# Altium schematic sheet Sheet1.SchDoc
size A; SheetNumber: 1; SheetTotal: 1
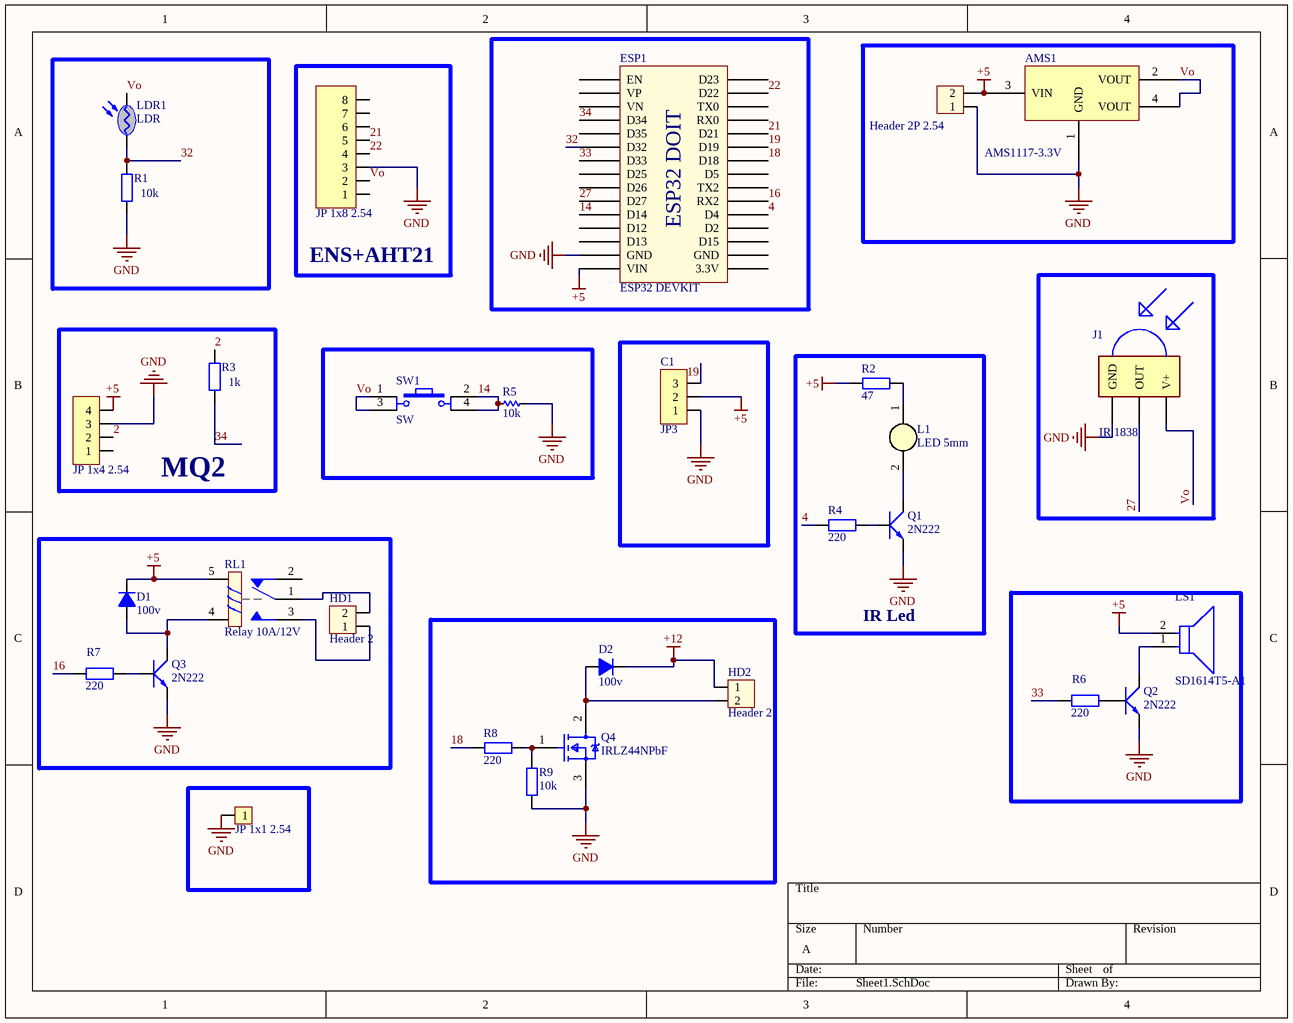
[diagram p0: Sheet1.SchDoc]

## Parts
AMS1  AMS1117-3.3V  [SOT223]
C1  JP3  [JP3-C1T]
D1  100v  [DIODE 1A]
D2  100v  [DIODE 1A]
ESP1  ESP32 DEVKIT  [ESP32 WROOM 32 KIT]
H1  Header 2P 2.54  [XH2.54M-2]
HD1  Header 2  [HED2]
HD2  Header 2  [HED2]
J1  IR 1838  [IR 1838]
JP1  JP 1x8 2.54  [JP 1x8 DT]
JP2  JP 1x4 2.54  [JP 1x4 CT]
JP3  JP 1x1 2.54  [JP 1x1 DT]
L1  LED 5mm  [LED-5MM-WHITE]
LDR1  LDR  [CDS]
LS1  SD1614T5-A1  [FP-SD1614T5-A1-MFG]
Q1  2N222  [TO92-123]
Q2  2N222  [TO92-123]
Q3  2N222  [TO92-123]
Q4  IRLZ44NPbF  [FP-PG-TO220-3-MFG]
R1  10k  [R1/4W]
R2  47  [R1/4W]
R3  1k  [R1/4W]
R4  220  [R1/4W]
R5  10k  [RES-1/2W]
R6  220  [R1/4W]
R7  220  [R1/4W]
R8  220  [R1/4W]
R9  10k  [R1/4W]
RL1  Relay 10A/12V  [RELAY 5]
SW1  SW  [SW4]

## Blocks framed on the sheet
ENS+AHT21: JP1
MQ2: JP2 R3
IR Led: L1 Q1 R2 R4

## Nets
+5: AMS1.3(VIN) C1.2 D1.2(K) ESP1.15(VIN) H1.2 JP2.4 LS1.2(A) R2.1 RL1.5
+12: D2.2(K) HD2.1
GND: AMS1.1(GND) C1.1 ESP1.14(GND) H1.1 J1.GND JP1.3 JP2.3 JP3.1 Q1.1(E) Q2.1(E) Q3.1(E) Q4.3(S) R1.1 R5.1 R9.1
2: JP2.2 R3.2
4: ESP1.20(D4) R4.1
14: ESP1.11(D14) R5.2 SW1.2 SW1.4
16: ESP1.21(RX2) R7.1
18: ESP1.24(D18) R8.1
19: C1.3 ESP1.25(D19)
21: ESP1.26(D21) JP1.5
22: ESP1.29(D22) JP1.4
27: ESP1.10(D27) J1.OUT
32: ESP1.6(D32) LDR1.1(A) R1.2
33: ESP1.7(D33) R6.1
34: ESP1.4(D34) R3.1
Vo: AMS1.2(VOUT) AMS1.4(VOUT) J1.VCC(V+) JP1.2 LDR1.2(K) SW1.1 SW1.3
NetD1_1: D1.1(A) Q3.3(C) RL1.4
NetD2_1: D2.1(A) HD2.2 Q4.2(D)
NetHD1_1: HD1.1 RL1.3
NetHD1_2: HD1.2 RL1.1
NetL1_1: L1.1(A) R2.2
NetL1_2: L1.2(K) Q1.3(C)
NetLS1_1: LS1.1(C) Q2.3(C)
NetQ1_2: Q1.2(B) R4.2
NetQ2_2: Q2.2(B) R6.2
NetQ3_2: Q3.2(B) R7.2
NetQ4_1: Q4.1(G) R8.2 R9.2

Not connected (* = marked no-connect by the designer): ESP1 1(EN) 2(VP) 3(VN) 5(D35) 8(D25) 9(D26) 12(D12) 13(D13) 16(3.3V) 17(GND) 18(D15) 19(D2) 22(TX2) 23(D5) 27(RX0) 28(TX0) 30(D23); JP1 1 6 7 8; JP2 1; RL1 2

## Notes on the sheet
- (in symbol ESP32 WROOM 32 KIT) ESP32 DOIT

## Library data of the parts
AMS1 = AMS1117 SMD: Dán; Value: AMS1117-3.3V SOT223; Don_Vi: Con; Ma_Hang: MH000596; Ghi_Chu: *; Kieu_Chan: *; Chung_Loai: Dán
C1 = JP3: WR-PHD 2.54 mm Angled Socket Header; Manufacturer: W¨¹rth Elektronik eiSos GmbH; partNo: 613003143121; ComponentLink1 Description: Manufacturer; ComponentLink2 Description: Datasheet; NoPins: 03; Created Date: 29 March 2013; ComponentLink1URL: http://www.we-online.com; ComponentLink2URL: http://katalog.we-online.de/em/datasheet/6130xx143121.pdf; Created by: Karrer Zheng
D1 D2 = Diode 1N4007: Cắm; Ten_Linh_Kien: Diode 1N4007 1A (DIP); Don_Vi: Con; Ma_Hang: MH001063; Ghi Chu: *; Kieu_Chan: *; Chung_Loai: Cắm
ESP1 = ESP32 WROOM 32 KIT
H1 = Header 2P 2.54 Duc Thang: Cắm; Ten_Linh_Kien: Header 2P XH2.54-2P Đực Thẳng; Don_Vi: Con; Ma_Hang: MH001283; Chung_Loai: Cắm
HD1 HD2 = Hed2: Header 2 (Green); Value: Header 2
J1 = IR 1838: IR Receiver and Demodulator; MP: TSOP1838; Value: *; Package: None; Availability: Unavailable; Price: None
JP1 = JP 1x8 2.54 Duc Thang: Cắm; Ten_Linh_Kien: Jump Đơn Đực 2.54MM 1x40P Thẳng 11MM; Don_Vi: Con; Ma_Hang: MH000903; Ghi_Chu: *; Kieu_Chan: *; Chung_Loai: Cắm
JP2 = JP 1x4 2.54 Cai Thang: Cắm; Ten_Linh_Kien: Jump Đơn Cái 2.54MM 1x20P Thẳng; Don_Vi: Con; Ma_Hang: MH004006; Ghi_Chu: *; Kieu_Chan: *; Chung_Loai: Cắm
JP3 = JP 1x1 2.54 Duc Cong: Cắm; Ten_Linh_Kien: Jump Đơn Đực 2.54MM 1x40P Cong Đứng; Don_Vi: Con; Ma_Hang: MH000904; Ghi_Chu: *; Kieu_Chan: *; Chung_Loai: Cắm
L1 = LED 5mm Trang: Cắm; Don_Vi: Con; Ma_Hang: MH008983; Ten_Linh_Kien: Led 5MM Trắng Đục (1000c); Ghi_Chu: *; Kieu_Chan: *; Chung_Loai: Cắm
LDR1 = LDR: Quang Tro
LS1 = CMP-08413-000005-1: BUZZER MAGNETIC 5V 80DB 2048HZ 1; Frequency: 2.048kHz; Operating Supply Current: 80mA; Max Operating Temperature: 85°C; Min Operating Temperature: -40°C; Voltage Rating: 5V; Termination: PC Pins; Sensing Method: Magnetic; Mount: Panel
Q1-Q3 = 2N222: NPN 600mW, ECB; Value: C1815
Q4 = CMP-32901-000488-1: MOSFET N-CH 55V 47A TO220AB; Turn-On Delay Time: 11ns; Gate to Source Voltage (Vgs): 16V; Element Configuration: Single; Rds On Max: 22mR; Turn-Off Delay Time: 26ns; Max Power Dissipation: 110W; Threshold Voltage: 2V; Drain to Source Resistance: 35mR; Input Capacitance: 1.7nF; Continuous Drain Current (ID): 47A; Case/Package: TO-220; Lead Free: Lead Free; Halogen Free: Halogen Free; Packaging: Rail/Tube; Length: 0.414inch; Min Operating Temperature: -55°C; REACH SVHC: No SVHC; Number of Pins: 3; Width: 0.185inch; Drain to Source Voltage (Vdss): 55V; Power Dissipation: 110W; RoHS Compliant: Yes; Max Operating Temperature: 175°C; Height: 0.6inch; Max Dual Supply Voltage: 55V; Drain to Source Breakdown Voltage: 55V; Mount: Through Hole
R1-R4 R6-R9 = R1/4W: Resistor 1/4W; Value: R1/4W - 1K
R5 = Res: Manufacturer: Generic Components; Class: Passive; SubClass: R; Published: 08/06/2000; Publisher: Altium Hobart Technology Centre
RL1 = Relay 5: Relay SPDT,10A - 12VDC 5 Pin; Value: Relay SPDT, 10A, 12V
SW1 = SW4: Switch button 4 pin; Value: Button chip 4 pin